# EAGLE design PetitCool_SensorShield (EAGLE 7.3.0)
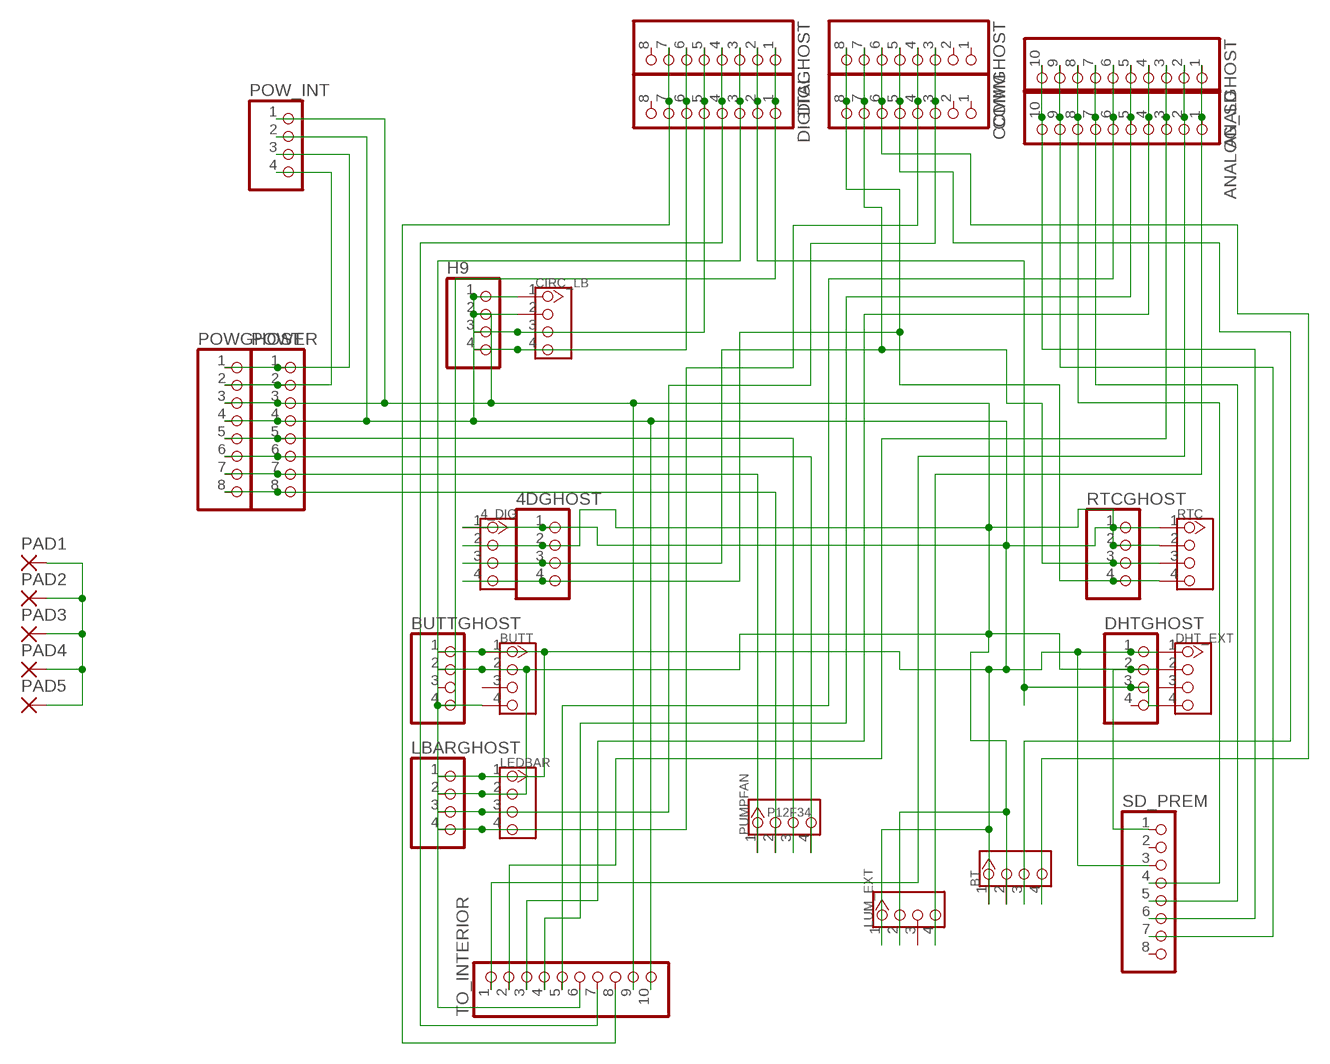
[diagram p0: schematic, sheet 1]

## Parts
4_DIG  TWIG-4P-2.0-2.0  [4P-2.0]
4DGHOST  PINHD-1X4  [1X04]
ANALGHOST  PINHD-1X10  [1X10]
ANALOG_SD  PINHD-1X10  [1X10]
BT  TWIG-4P-2.0-2.0  [4P-2.0]
BUTT  TWIG-4P-2.0-2.0  [4P-2.0]
BUTTGHOST  PINHD-1X4  [1X04]
CIRC_LB  TWIG-4P-2.0-2.0  [4P-2.0]
COMM  PINHD-1X8  [1X08]
COMMGHOST  PINHD-1X8  [1X08]
DHT_EXT  TWIG-4P-2.0-2.0  [4P-2.0]
DHTGHOST  PINHD-1X4  [1X04]
DIGGHOST  PINHD-1X8  [1X08]
DIGITAL  PINHD-1X8  [1X08]
H9  PINHD-1X4  [1X04]
LBARGHOST  PINHD-1X4  [1X04]
LEDBAR  TWIG-4P-2.0-2.0  [4P-2.0]
LUM_EXT  TWIG-4P-2.0-2.0  [4P-2.0]
PAD1  2,15/1,0  [2,15/1,0]
PAD2  2,15/1,0  [2,15/1,0]
PAD3  2,15/1,0  [2,15/1,0]
PAD4  2,15/1,0  [2,15/1,0]
PAD5  2,15/1,0  [2,15/1,0]
POW_INT  PINHD-1X4  [1X04]
POWER  PINHD-1X8  [1X08]
POWGHOST  PINHD-1X8  [1X08]
PUMPFAN  P12F34  TWIG-4P-2.0-2.0  [4P-2.0]
RTC  TWIG-4P-2.0-2.0  [4P-2.0]
RTCGHOST  PINHD-1X4  [1X04]
SD_PREM  PINHD-1X8  [1X08]
TO_INTERIOR  PINHD-1X10  [1X10]

## Nets
+5V: 4_DIG.2 4DGHOST.2 BT.2 BUTT.2 BUTTGHOST.2 CIRC_LB.2 DHT_EXT.2 DHTGHOST.2 H9.2 LBARGHOST.2 LEDBAR.2 LUM_EXT.2 POW_INT.1 POWER.3 POWGHOST.3 RTC.2 RTCGHOST.2 SD_PREM.1 TO_INTERIOR.9
+12V: POW_INT.3 POWER.1 POWGHOST.1
+FANS: POWER.5 POWGHOST.5 PUMPFAN.3
+PUMP: POWER.7 POWGHOST.7 PUMPFAN.1
A_PTSHIELD(A14): ANALGHOST.6 ANALOG_SD.6 TO_INTERIOR.5
BT_RX: BT.3 COMM.5 COMMGHOST.5
BT_TX: BT.4 COMM.6 COMMGHOST.6
BUTT(32): BUTT.4 BUTTGHOST.4 DIGGHOST.1 DIGITAL.1
CLB_CLK(42): CIRC_LB.4 DIGGHOST.6 DIGITAL.6 H9.4
CLB_DATA(40): CIRC_LB.3 DIGGHOST.5 DIGITAL.5 H9.3
D_PTSHIELD(44): DIGGHOST.7 DIGITAL.7 TO_INTERIOR.8
DHT_EXT(34): DHT_EXT.4 DHTGHOST.3 DIGGHOST.2 DIGITAL.2
DHT_INT(36): DIGGHOST.3 DIGITAL.3 TO_INTERIOR.6
GND_5V: 4_DIG.1 4DGHOST.1 BT.1 BUTT.1 BUTTGHOST.1 CIRC_LB.1 DHT_EXT.1 DHTGHOST.1 H9.1 LBARGHOST.1 LEDBAR.1 LUM_EXT.1 PAD1.1(P) PAD2.1(P) PAD3.1(P) PAD4.1(P) PAD5.1(P) POW_INT.2 POWER.4 POWGHOST.4 RTC.1 RTCGHOST.1 SD_PREM.3 TO_INTERIOR.10
GND_12V: POW_INT.4 POWER.2 POWGHOST.2
GND_FANS: POWER.6 POWGHOST.6 PUMPFAN.4
GND_PUMP: POWER.8 POWGHOST.8 PUMPFAN.2
LEDBAR_RX: COMM.3 COMMGHOST.3 LBARGHOST.3 LEDBAR.3
LEDBAR_TX: COMM.4 COMMGHOST.4 LBARGHOST.4 LEDBAR.4
LUM_EXT(A9): ANALGHOST.1 ANALOG_SD.1 LUM_EXT.4
LUM_INT(A10): ANALGHOST.2 ANALOG_SD.2 TO_INTERIOR.1
MOIST_1(A11): ANALGHOST.3 ANALOG_SD.3 TO_INTERIOR.2
MOIST_2(A12): ANALGHOST.4 ANALOG_SD.4 TO_INTERIOR.3
MOIST_3(A13): ANALGHOST.5 ANALOG_SD.5 TO_INTERIOR.4
PROXI_US(38): DIGGHOST.4 DIGITAL.4 TO_INTERIOR.7
SCL: 4_DIG.4 4DGHOST.4 COMM.8 COMMGHOST.8 RTC.4 RTCGHOST.4
SD_CLK(52): ANALGHOST.8 ANALOG_SD.8 SD_PREM.4
SD_CS(53): ANALGHOST.9 ANALOG_SD.9 SD_PREM.7
SD_DI(51): ANALGHOST.10 ANALOG_SD.10 SD_PREM.6
SD_DO(50): ANALGHOST.7 ANALOG_SD.7 SD_PREM.5
SDA: 4_DIG.3 4DGHOST.3 COMM.7 COMMGHOST.7 RTC.3 RTCGHOST.3
Unconnected: BUTT.3 BUTTGHOST.3 COMM.1 COMM.2 COMMGHOST.1 COMMGHOST.2 DHT_EXT.3 DHTGHOST.4 DIGGHOST.8 DIGITAL.8 LUM_EXT.3 SD_PREM.2 SD_PREM.8

## Library data of the parts
4_DIG BT BUTT CIRC_LB DHT_EXT LEDBAR LUM_EXT PUMPFAN RTC = Connector:TWIG-4P-2.0
4DGHOST BUTTGHOST DHTGHOST H9 LBARGHOST POW_INT RTCGHOST = pinhead:PINHD-1X4: PIN HEADER
ANALGHOST ANALOG_SD TO_INTERIOR = pinhead:PINHD-1X10: PIN HEADER
COMM COMMGHOST DIGGHOST DIGITAL POWER POWGHOST SD_PREM = pinhead:PINHD-1X8: PIN HEADER
PAD1-PAD5 = wirepad:2,15/1,0: THROUGH-HOLE PAD

## Board
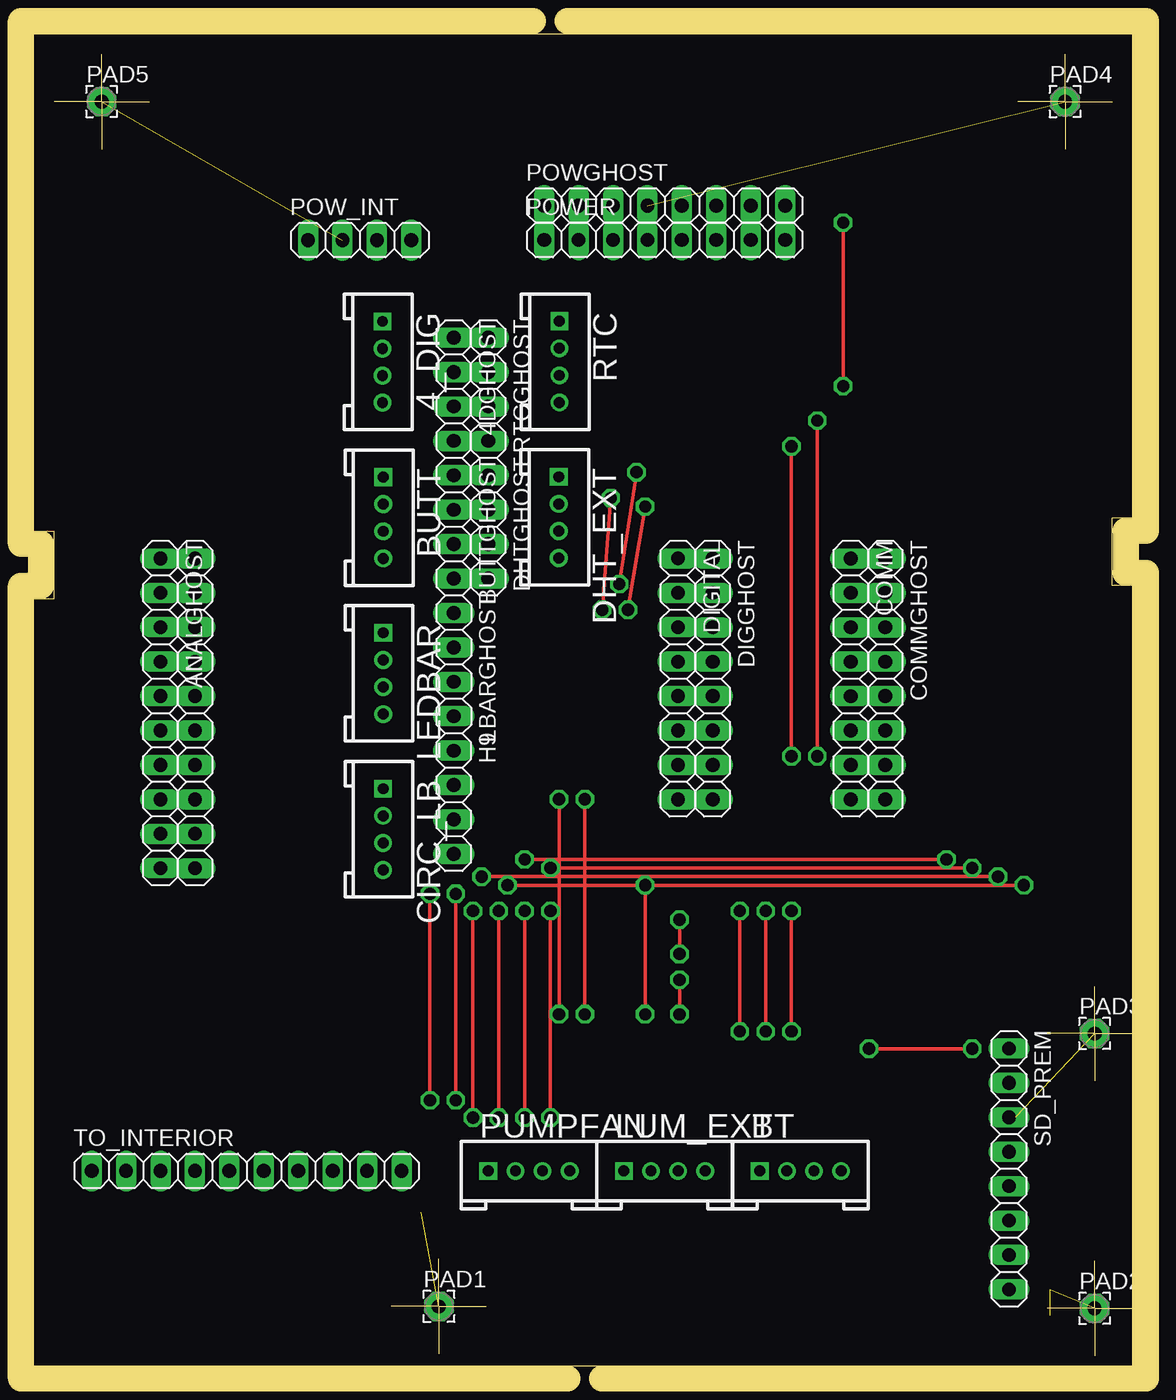
[diagram p1: board, top side]
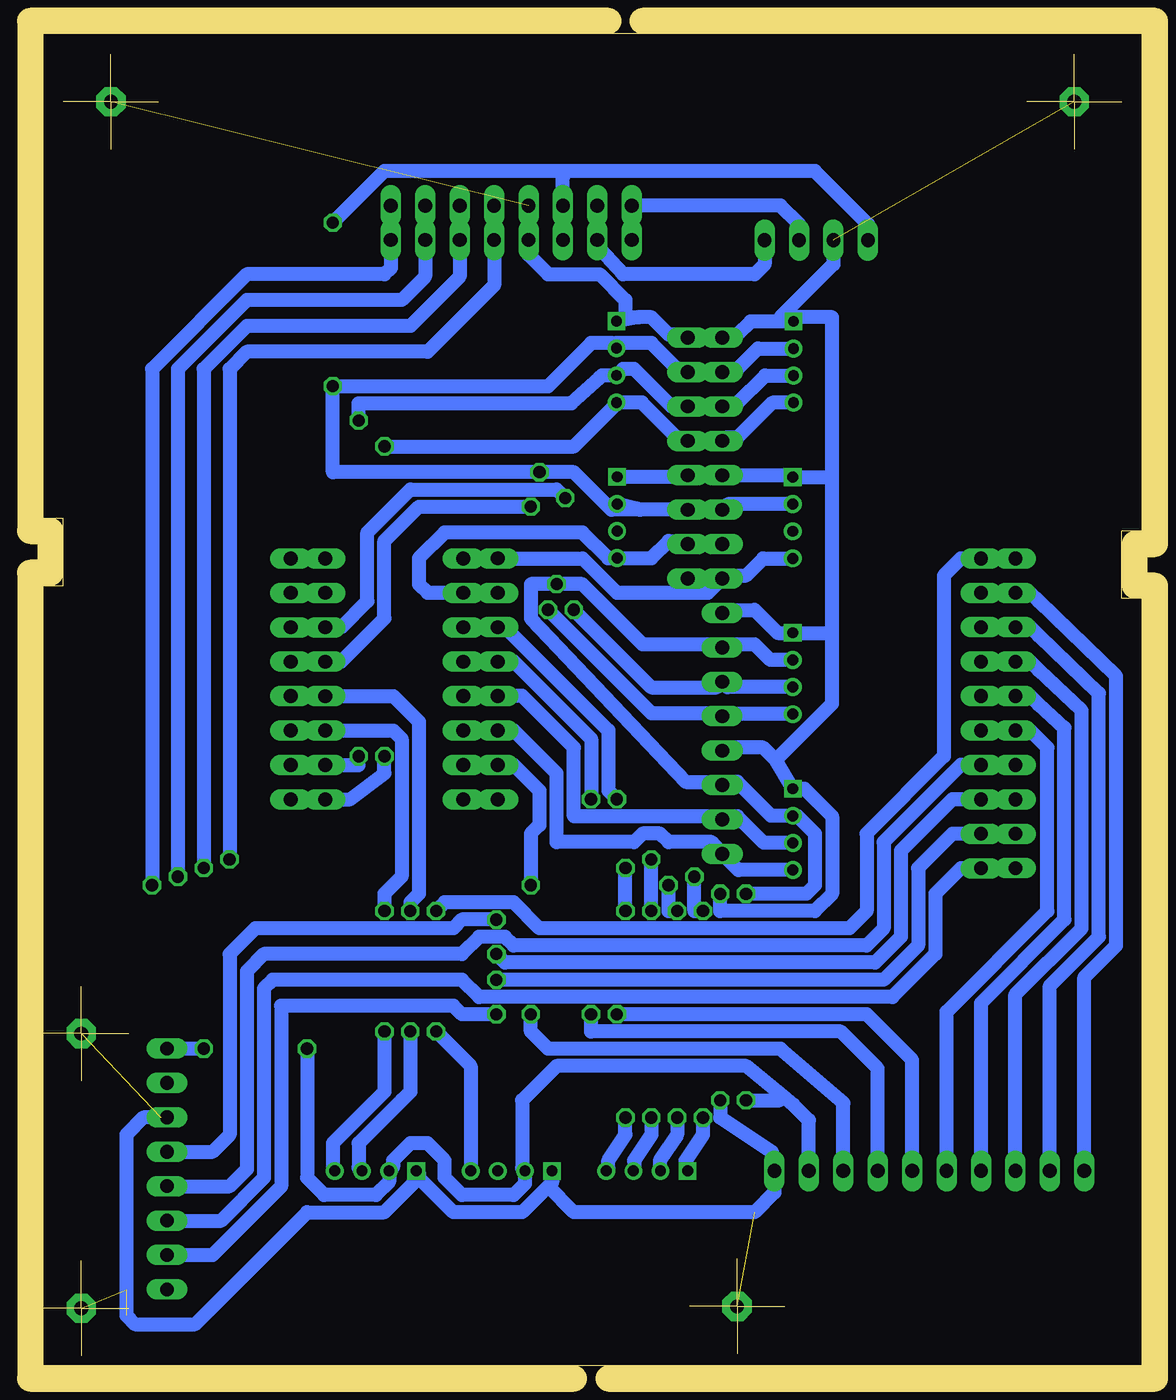
[diagram p2: board, bottom side, seen from below]

Size 81.75 x 98.28 mm. Coordinates in mm from the lower left corner, seen from the top.
Outline: 29.88,4.37 33.38,4.37
Outline: 29.88,4.37 29.88,0.87
Outline: 29.88,4.37 26.38,4.37
Outline: 29.88,4.37 29.88,7.87
Outline: 5,93.28 8.5,93.28
Outline: 5,93.28 5,89.78
Outline: 5,93.28 1.5,93.28
Outline: 5,93.28 5,96.78
Outline: 76.07,93.28 79.57,93.28
Outline: 76.07,93.28 76.07,89.78
Outline: 76.07,93.28 72.57,93.28
Outline: 76.07,93.28 76.07,96.78
Outline: 78.25,24.5 81.75,24.5
Outline: 78.25,24.5 78.25,21
Outline: 78.25,24.5 74.75,24.5
Outline: 78.25,24.5 78.25,28
Outline: 78.25,4.23 81.75,4.23
Outline: 78.25,4.23 78.25,0.73
Outline: 78.25,4.23 74.75,4.23
Outline: 78.25,4.23 78.25,7.73
Outline: 0,61.6 1.5,61.6 1.5,56.6 0,56.6 0,0 81.06,0 81.06,29.21 81.07,29.37 81.07,57.56 79.57,57.56 79.57,62.56 81.07,62.56 81.07,98.28 0,98.28 0,61.6
Copper layers (1*16): Top 0.035mm / dielectric 1.5mm / Bottom 0.035mm
Design rules "default": minimum track width 10mil, minimum drill 24mil, track to track 8mil, track to pad 8mil, pad to pad 8mil, via to via 8mil, smd to smd 8mil, copper to edge 40mil, drill to drill 8mil, minimum pad ring 10mil, minimum via ring 8mil, stop-mask expansion 4mil, vias tented up to drill 0mil, thermal gap 10mil
Milling: 14 lines

### Footprints (pad centres in the part's own frame; a part is rotated, then mirrored left to right if it is on the bottom)
4P-2.0 = drill 0.8 pad 1.27 square: 1 -3,0 | drill 0.8 pad 1.27: 2 -1,0; 3 1,0; 4 3,0
1X04 = drill 1.016 long: 1 -3.81,0; 2 -1.27,0; 3 1.27,0; 4 3.81,0
1X10 = drill 1.016 long: 1 -11.43,0; 2 -8.89,0; 3 -6.35,0; 4 -3.81,0; 5 -1.27,0; 6 1.27,0; 7 3.81,0; 8 6.35,0; 9 8.89,0; 10 11.43,0
1X08 = drill 1.016 long: 1 -8.89,0; 2 -6.35,0; 3 -3.81,0; 4 -1.27,0; 5 1.27,0; 6 3.81,0; 7 6.35,0; 8 8.89,0
2,15/1,0 = drill 1.016 pad 2.159 octagon: 1 0,0

### Placement (x,y rotation side)
4_DIG  25.71,74.06 270 top
4DGHOST  30.97,72.06 270 top
ANALGHOST  9.34,48.14 270 top
ANALOG_SD  11.88,48.14 270 top
BT  56.55,14.36 0 top
BUTT  25.77,62.57 270 top
BUTTGHOST  30.97,61.89 270 top
CIRC_LB  25.76,39.58 270 top
COMM  60.27,50.68 270 top
COMMGHOST  62.81,50.68 270 top
DHT_EXT  38.73,62.59 270 top
DHTGHOST  33.52,61.89 270 top
DIGGHOST  50.07,50.68 270 top
DIGITAL  47.53,50.68 270 top
H9  30.97,41.57 270 top
LBARGHOST  30.98,51.73 270 top
LEDBAR  25.77,51.08 270 top
LUM_EXT  46.53,14.37 0 top
PAD1  29.88,4.37 0 top
PAD2  78.25,4.23 0 top
PAD3  78.25,24.51 0 top
PAD4  76.07,93.28 0 top
PAD5  5,93.28 0 top
POW_INT  24.04,83.06 0 top
POWER  46.53,83.07 0 top
POWGHOST  46.53,85.61 0 top
PUMPFAN  36.53,14.36 0 top
RTC  38.77,74.08 270 top
RTCGHOST  33.51,72.05 270 top
SD_PREM  71.94,14.51 270 top
TO_INTERIOR  15.69,14.37 0 top

### Tracks (layer width: path | path; a pad name or v marks a point on that pad's centre or on a via)
+5V  (via drill 0.9)
  Top 0.254: v69.22,23.39 v61.6,23.39 | v59.7,84.35 v59.7,72.28 | v29.22,34.82 v29.22,19.58 | v43.19,57.68 v44.46,65.93
  Bottom 1.016: RTCGHOST.2 | RTCGHOST.2 34.07,73.32 36.2,75.46 38.77,75.46 RTC.2 39.15,75.46 40.65,75.46 43.82,72.28 v59.7,72.28 59.7,65.93 v44.46,65.93 41.92,65.93 39.15,63.16 37.03,63.16 | BUTT.2 30.56,63.57 BUTTGHOST.2 DHTGHOST.2 | DHTGHOST.2 | DHTGHOST.2 37.03,63.16 | 37.03,63.16 DHT_EXT.2 | LEDBAR.2 27.43,52.08 28.58,53.23 30.75,53.23 | 30.75,53.23 LBARGHOST.2 | POWER.3 POWGHOST.3 42.72,87.69 | v61.6,23.39 61.6,13.86 60.33,12.59 56.52,12.59 55.55,13.57 BT.2 55.25,14.66 55.25,15.13 53.98,16.4 52.71,16.4 51.44,15.13 51.44,13.86 50.17,12.59 46.36,12.59 45.53,13.43 LUM_EXT.2 45.73,14.57 45.73,19.58 43.19,22.12 29.22,22.12 26.45,19.86 | TO_INTERIOR.9 24.58,18.12 25.73,19.26 26.45,19.86 | 30.75,53.23 36.84,53.23 41.28,57.68 v43.19,57.68 45.09,57.68 45.09,55.14 33.66,43.07 31.2,43.07 H9.2 30.74,43.07 29.85,43.07 27.36,40.58 CIRC_LB.2 25.45,40.58 24.14,39.26 24.14,35.45 24.77,34.82 v29.22,34.82 | 42.72,87.69 42.55,88.16 | 42.89,88.16 55.89,88.16 v59.7,84.35 | v69.22,23.39 70.66,23.39 SD_PREM.1 | 42.55,88.16 24.14,88.16 20.23,84.25 POW_INT.1 | 42.55,88.16 42.89,88.16 | 42.89,88.16 42.72,87.69 | v29.22,19.58 26.73,19.58 26.45,19.86 | 4_DIG.2 28.35,75.06 29.85,73.55 30.74,73.55 4DGHOST.2 RTCGHOST.2
+12V
  Bottom 1.016: POWER.1 POWGHOST.1 26.68,85.62 25.31,84.25 POW_INT.3
+FANS  (via drill 0.9)
  Top 0.254: v36.2,18.31 v36.2,33.55 | v36.2,37.36 v67.32,37.36
  Bottom 1.016: POWGHOST.5 POWER.5 | POWER.5 | v36.2,18.31 36.2,17.04 37.47,15.13 37.47,14.5 37.47,14.42 PUMPFAN.3 | v36.2,33.55 v36.2,37.36 | POWER.5 47.8,79.74 52.71,74.82 66.05,74.82 67.32,73.55 v67.32,37.36
+PUMP  (via drill 0.9)
  Top 0.254: v32.39,18.31 v32.39,33.55 | v33.03,36.09 v71.13,36.09
  Bottom 1.016: POWGHOST.7 POWER.7 | POWER.7 | v32.39,18.31 32.39,17.04 33.66,15.13 33.66,14.5 33.39,14.5 PUMPFAN.1 | v32.39,33.55 33.03,33.55 v33.03,36.09 | POWER.7 52.88,80.37 54.62,78.63 66.05,78.63 71.13,73.55 v71.13,36.09
A_PTSHIELD(A14)
  Bottom 1.016: TO_INTERIOR.5 14.42,26.12 6.99,33.55 6.99,45.61 8.25,46.87 ANALGHOST.6 ANALOG_SD.6
BT_RX  (via drill 0.9)
  Top 0.254: v53.98,33.55 v53.98,24.66
  Bottom 0.254: COMMGHOST.5
  Bottom 1.016: COMMGHOST.5 COMM.5 55.24,49.41 53.35,47.52 53.35,34.82 53.98,34.18 v53.98,33.55 | v53.98,24.66 53.98,20.21 54.62,19.58 57.79,16.4 57.79,14.61 BT.3
BT_TX  (via drill 0.9)
  Top 0.254: v55.89,33.55 v55.89,24.66
  Bottom 0.254: COMMGHOST.6
  Bottom 1.016: COMMGHOST.6 COMM.6 55.24,46.87 54.62,46.25 54.62,36.09 55.89,34.82 v55.89,33.55 | v55.89,24.66 55.89,20.21 59.7,16.4 59.7,14.51 BT.4
BUTT(32)
  Bottom 0.254: DIGGHOST.1
  Bottom 1.016: DIGGHOST.1 DIGITAL.1 41.27,59.57 38.74,57.04 32.01,57.04 BUTTGHOST.4 30.74,58.31 29.22,58.31 27.96,59.57 BUTT.4
CLB_CLK(42)
  Bottom 0.254: DIGGHOST.6
  Bottom 1.016: CIRC_LB.4 29.79,36.58 H9.4 31.76,38.63 34.93,38.63 35.57,39.26 36.84,39.26 37.47,38.63 43.19,38.63 43.19,43.71 46.36,46.88 47.51,46.88 DIGITAL.6 DIGGHOST.6
CLB_DATA(40)
  Bottom 0.254: DIGGHOST.5
  Bottom 1.016: CIRC_LB.3 27.9,38.58 29.85,40.53 30.74,40.53 H9.3 31.35,40.3 31.76,40.53 41.92,40.53 41.92,45.61 45.73,49.42 47.51,49.42 DIGITAL.5 DIGGHOST.5
D_PTSHIELD(44)  (via drill 0.9)
  Top 0.254: v45.09,25.93 v45.09,35.45
  Bottom 0.254: DIGGHOST.7
  Bottom 1.016: DIGGHOST.7 DIGITAL.7 47.51,44.34 46.36,44.34 44.46,42.44 44.46,39.9 45.09,39.26 v45.09,35.45 | TO_INTERIOR.8 22.04,19.39 26.68,23.39 43.82,23.39 45.09,24.66 v45.09,25.93
DHT_EXT(34)
  Bottom 0.254: DIGGHOST.2
  Bottom 1.016: DIGITAL.2 DIGGHOST.2 | DIGGHOST.2 50.09,57.04 52.71,57.04 53.35,57.68 53.35,59.58 51.44,61.49 41.28,61.49 39.39,59.59 DHT_EXT.4 36.2,59.59 34.93,60.85 33.75,60.85 DHTGHOST.3
DHT_INT(36)  (via drill 0.9)
  Top 0.254: v38.74,25.93 v38.74,41.8
  Bottom 0.254: DIGGHOST.3
  Bottom 1.016: DIGGHOST.3 DIGITAL.3 47.51,54.5 47,54.5 39.38,46.88 39.38,42.44 v38.74,41.8 | TO_INTERIOR.6 16.96,22.56 20.33,25.93 v38.74,25.93
GND_5V  (via drill 0.9)  (6 unrouted)
  Top 0.254: v31.12,34.82 v31.12,19.58
  Bottom 1.016: 37.15,77.36 36.2,77.36 34.93,76.09 33.66,76.09 33.51,75.95 RTCGHOST.1 4DGHOST.1 30.74,76.09 29.85,76.09 28.89,77.06 4_DIG.1 26.68,77.37 | 37.15,77.36 37.21,77.36 | 37.21,77.36 RTC.1 37.15,77.36 | 27.03,44.7 CIRC_LB.1 24.91,42.58 22.87,40.53 22.87,34.82 24.14,33.55 31.12,33.55 v31.12,34.82 | 27.03,44.7 27.95,45.61 30.74,45.61 H9.1 | 26.68,77.37 22.77,81.28 POW_INT.2 | POWGHOST.4 POWER.4 45.26,81.98 43.82,80.54 40.01,80.54 38.11,78.63 38.11,77.36 37.21,77.36 | 27.03,44.7 22.87,48.86 22.87,53.87 | SD_PREM.3 72.39,18.32 73.67,18.31 74.94,17.04 74.94,3.7 74.3,3.07 69.86,3.07 61.6,11.32 55.89,11.32 53.35,13.86 | 53.35,13.86 53.35,14.16 BT.1 | LUM_EXT.1 43.53,13.53 43.82,13.23 | 43.82,13.23 45.73,11.32 50.81,11.32 53.35,13.86 | 43.82,13.23 41.92,11.32 28.58,11.32 27.12,12.79 TO_INTERIOR.10 27.31,14.56 27.31,15.77 31.12,18.31 v31.12,19.58 | 22.87,53.87 22.87,65.3 | 22.87,65.3 22.87,77.36 26.68,77.37 | 22.87,53.87 23.08,54.08 LEDBAR.1 26.89,54.08 28.58,55.77 30.75,55.77 LBARGHOST.1 | DHT_EXT.1 33.63,65.59 DHTGHOST.1 BUTTGHOST.1 | BUTTGHOST.1 | BUTTGHOST.1 25.9,65.7 BUTT.1 23.14,65.57 22.87,65.3
GND_12V
  Bottom 1.016: POWGHOST.2 POWER.2 40.01,83.07 40.01,82.44 38.29,80.54 28.58,80.54 27.85,81.28 POW_INT.4
GND_FANS  (via drill 0.9)
  Top 0.254: v38.11,18.31 v38.11,33.55 | v38.11,36.72 v69.22,36.72
  Bottom 1.016: POWGHOST.6 POWER.6 | POWER.6 | PUMPFAN.4 39.51,14.36 39.38,14.5 39.38,15.13 38.11,17.04 v38.11,18.31 | v38.11,33.55 v38.11,36.72 | POWER.6 50.34,80.37 53.98,76.73 66.05,76.73 69.22,73.55 v69.22,36.72
GND_PUMP  (via drill 0.9)
  Top 0.254: v34.3,18.31 v34.3,33.55 | v34.93,35.45 v73.03,35.45
  Bottom 1.016: POWGHOST.8 POWER.8 | POWER.8 | v34.3,18.31 34.3,17.04 35.57,15.13 35.57,14.5 35.57,14.41 PUMPFAN.2 | v34.3,33.55 34.93,33.55 v34.93,35.45 | POWER.8 55.42,81.01 55.89,80.54 66.05,80.54 73.03,73.55 v73.03,35.45
LEDBAR_RX  (via drill 0.9)
  Top 0.254: v42.55,64.03 v41.92,55.77
  Bottom 1.016: LEDBAR.3 30.59,50.08 LBARGHOST.3 31.38,50.06 36.2,50.06 v41.92,55.77 | COMMGHOST.3 COMM.3 59.08,54.49 57.16,56.41 57.16,61.49 53.98,64.66 43.19,64.66 v42.55,64.03
LEDBAR_TX  (via drill 0.9)
  Top 0.254: v45.09,63.39 v43.82,55.77
  Bottom 0.254: COMMGHOST.4
  Bottom 1.016: LEDBAR.4 30.82,48.08 LBARGHOST.4 31.21,48.15 36.2,48.15 v43.82,55.77 | COMMGHOST.4 COMM.4 59.08,51.95 55.89,55.14 55.89,60.85 53.35,63.39 v45.09,63.39
LUM_EXT(A9)  (via drill 0.9)
  Top 0.254: v52.08,33.55 v52.08,24.66
  Bottom 1.016: ANALGHOST.1 ANALOG_SD.1 12.71,59.58 13.36,59.57 14.63,58.3 14.61,44.98 20.33,39.26 20.33,33.55 21.6,32.28 44.46,32.28 46.36,34.18 51.44,34.18 v52.08,33.55 | v52.08,24.66 49.54,22.12 LUM_EXT.4
LUM_INT(A10)
  Bottom 1.016: ANALOG_SD.2 ANALGHOST.2 8.25,57.03 7.63,56.41 1.91,50.88 1.91,31.01 4.26,28.66 TO_INTERIOR.1
MOIST_1(A11)
  Bottom 1.016: ANALOG_SD.3 ANALGHOST.3 8.25,54.49 7.63,53.87 3.18,49.61 3.18,31.64 6.8,28.03 TO_INTERIOR.2
MOIST_2(A12)
  Bottom 1.016: ANALOG_SD.4 ANALGHOST.4 8.25,51.95 7.63,51.33 4.45,48.34 4.45,32.28 9.34,27.39 TO_INTERIOR.3
MOIST_3(A13)
  Bottom 1.016: ANALOG_SD.5 ANALGHOST.5 8.25,49.41 7.63,48.79 5.72,47.07 5.72,32.91 11.88,26.76 TO_INTERIOR.4
PROXI_US(38)  (via drill 0.9)
  Top 0.254: v40.65,25.93 v40.65,41.8
  Bottom 0.254: DIGGHOST.4
  Bottom 1.016: DIGGHOST.4 DIGITAL.4 47.51,51.96 46.36,51.96 40.65,46.25 v40.65,41.8 | TO_INTERIOR.7 19.5,21.93 22.23,24.66 40.65,24.66 v40.65,25.93
SCL  (via drill 0.9)
  Top 0.254: v55.89,44.98 v55.89,67.84
  Bottom 0.254: COMMGHOST.8
  Bottom 1.016: 4_DIG.4 27.27,71.06 29.85,68.47 30.74,68.47 4DGHOST.4 RTCGHOST.4 34.07,68.24 36.9,71.08 RTC.4 38.77,70.99 41.92,67.84 v55.89,67.84 | COMMGHOST.8 COMM.8 58.45,41.79 55.89,43.71 v55.89,44.98
SD_CLK(52)  (via drill 0.9)
  Top 0.254: v47.63,30.37 v47.63,32.91
  Bottom 1.016: ANALGHOST.8 ANALOG_SD.8 13.99,41.79 17.79,37.99 17.79,31.64 19.69,29.74 47,29.74 v47.63,30.37 | SD_PREM.4 68.58,15.78 67.32,17.04 67.32,30.37 65.41,32.28 50.81,32.28 50.17,32.91 v47.63,32.91
SD_CS(53)  (via drill 0.9)
  Top 0.254: v47.63,28.47 v47.63,25.93
  Bottom 1.016: ANALGHOST.9 ANALOG_SD.9 13.99,39.25 16.52,36.72 16.52,31.01 19.06,28.47 v47.63,28.47 | SD_PREM.7 68.58,8.16 63.51,13.23 63.51,26.56 50.81,26.56 50.17,25.93 v47.63,25.93
SD_DI(51)
  Bottom 1.016: ANALGHOST.10 ANALOG_SD.10 13.36,36.71 15.25,34.82 15.25,30.37 18.42,27.2 48.9,27.2 50.17,28.47 64.14,28.47 64.78,27.83 64.78,13.86 67.94,10.7 SD_PREM.6
SD_DO(50)
  Bottom 1.016: ANALGHOST.7 ANALOG_SD.7 13.36,44.33 19.06,38.63 19.06,32.28 20.33,31.01 46.36,31.01 47,31.64 48.9,31.64 50.17,30.37 64.78,30.37 66.05,29.1 66.05,14.5 67.31,13.24 SD_PREM.5
SDA  (via drill 0.9)
  Top 0.254: v57.79,44.98 v57.79,69.74
  Bottom 0.254: COMMGHOST.7
  Bottom 1.016: RTCGHOST.3 | COMMGHOST.7 COMM.7 57.81,44.33 v57.79,44.98 | RTCGHOST.3 34.7,70.78 37.47,73.55 38.29,73.55 RTC.3 39.85,73.08 40.01,72.92 42.1,71.01 57.79,71.01 v57.79,69.74 | 4_DIG.3 27.81,73.06 29.85,71.01 30.74,71.01 4DGHOST.3 RTCGHOST.3